# EAGLE schematic Schematic (EAGLE 8.7.1)
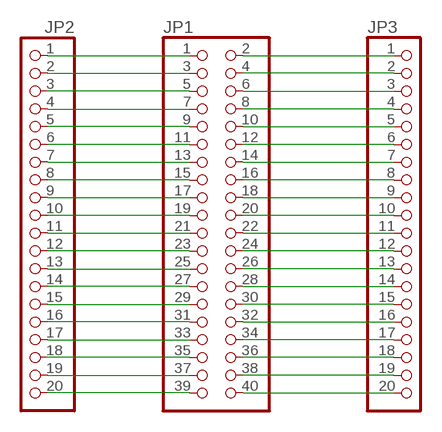
[diagram p0: schematic, sheet 1]

## Parts
JP1  PINHD-2X20  [2X20]
JP2  PINHD-1X20  [1X20]
JP3  PINHD-1X20  [1X20]

## Nets
GND: JP1.21 JP2.11
N$1: JP1.1 JP2.1
N$2: JP1.9 JP2.5
N$3: JP1.3 JP2.2
N$4: JP1.5 JP2.3
N$5: JP1.7 JP2.4
N$6: JP1.11 JP2.6
N$7: JP1.13 JP2.7
N$8: JP1.15 JP2.8
N$9: JP1.17 JP2.9
N$10: JP1.19 JP2.10
N$11: JP1.2 JP3.1
N$13: JP1.25 JP2.13
N$14: JP1.27 JP2.14
N$15: JP1.29 JP2.15
N$16: JP1.31 JP2.16
N$17: JP1.33 JP2.17
N$18: JP1.35 JP2.18
N$19: JP1.37 JP2.19
N$20: JP1.39 JP2.20
N$21: JP1.40 JP3.20
N$22: JP1.38 JP3.19
N$23: JP1.36 JP3.18
N$24: JP1.34 JP3.17
N$25: JP1.32 JP3.16
N$26: JP1.30 JP3.15
N$27: JP1.28 JP3.14
N$28: JP1.26 JP3.13
N$29: JP1.24 JP3.12
N$30: JP1.22 JP3.11
N$31: JP1.20 JP3.10
N$32: JP1.18 JP3.9
N$33: JP1.16 JP3.8
N$34: JP1.14 JP3.7
N$35: JP1.12 JP3.6
N$36: JP1.10 JP3.5
N$37: JP1.8 JP3.4
N$38: JP1.6 JP3.3
N$39: JP1.4 JP3.2
VCC: JP1.23 JP2.12

## Library data of the parts
JP1 = pinhead:PINHD-2X20: PIN HEADER
JP2 JP3 = pinhead:PINHD-1X20: PIN HEADER